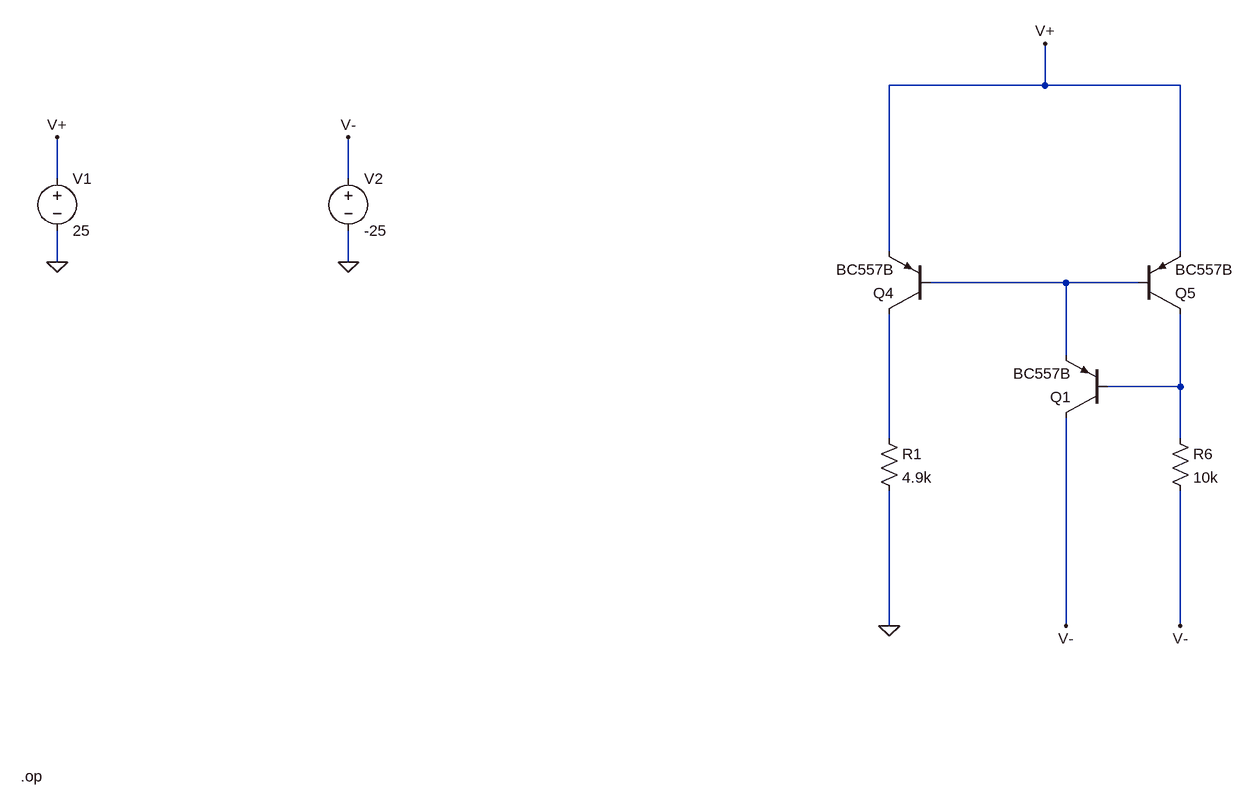
[diagram p0: schematic fte_corriente.asc]
fte_corriente.asc, the LTspice schematic file:
Version 4
SHEET 1 2520 1220
WIRE 1696 -1360 1696 -1424
WIRE 1696 -1360 1456 -1360
WIRE 1904 -1360 1696 -1360
WIRE 176 -1216 176 -1280
WIRE 624 -1216 624 -1280
WIRE 1456 -1104 1456 -1360
WIRE 1904 -1104 1904 -1360
WIRE 176 -1088 176 -1136
WIRE 624 -1088 624 -1136
WIRE 1728 -1056 1520 -1056
WIRE 1840 -1056 1728 -1056
WIRE 1728 -944 1728 -1056
WIRE 1904 -896 1904 -1008
WIRE 1904 -896 1792 -896
WIRE 1456 -816 1456 -1008
WIRE 1904 -816 1904 -896
WIRE 1456 -528 1456 -736
WIRE 1728 -528 1728 -848
WIRE 1904 -528 1904 -736
FLAG 624 -1088 0
FLAG 176 -1088 0
FLAG 176 -1280 V+
FLAG 624 -1280 V-
FLAG 1904 -528 V-
FLAG 1696 -1424 V+
FLAG 1456 -528 0
FLAG 1728 -528 V-
DATAFLAG 1456 -1200 ""
DATAFLAG 1728 -1056 ""
DATAFLAG 1456 -944 "Ic(Q4)"
DATAFLAG 1904 -944 "Ic(Q5)"
SYMBOL voltage 176 -1232 R0
WINDOW 123 0 0 Left 0
WINDOW 39 0 0 Left 0
SYMATTR InstName V1
SYMATTR Value 25
SYMBOL voltage 624 -1232 R0
WINDOW 123 0 0 Left 0
WINDOW 39 0 0 Left 0
SYMATTR InstName V2
SYMATTR Value -25
SYMBOL pnp 1520 -1008 R180
SYMATTR InstName Q4
SYMATTR Value BC557B
SYMBOL pnp 1840 -1008 M180
SYMATTR InstName Q5
SYMATTR Value BC557B
SYMBOL res 1888 -832 R0
SYMATTR InstName R6
SYMATTR Value 10k
SYMBOL res 1440 -832 R0
SYMATTR InstName R1
SYMATTR Value 4.9k
SYMBOL pnp 1792 -848 R180
SYMATTR InstName Q1
SYMATTR Value BC557B
TEXT 120 -296 Left 2 !.op

The netlist it stands for:
* fte_corriente.asc
V1 V+ 0 25
V2 V- 0 -25
Q4 N003 N001 V+ 0 BC557B
Q5 N002 N001 V+ 0 BC557B
R6 N002 V- 10k
R1 N003 0 4.9k
Q1 V- N002 N001 0 BC557B
.model NPN NPN
.model PNP PNP
.lib standard.bjt
.op
.backanno
.end